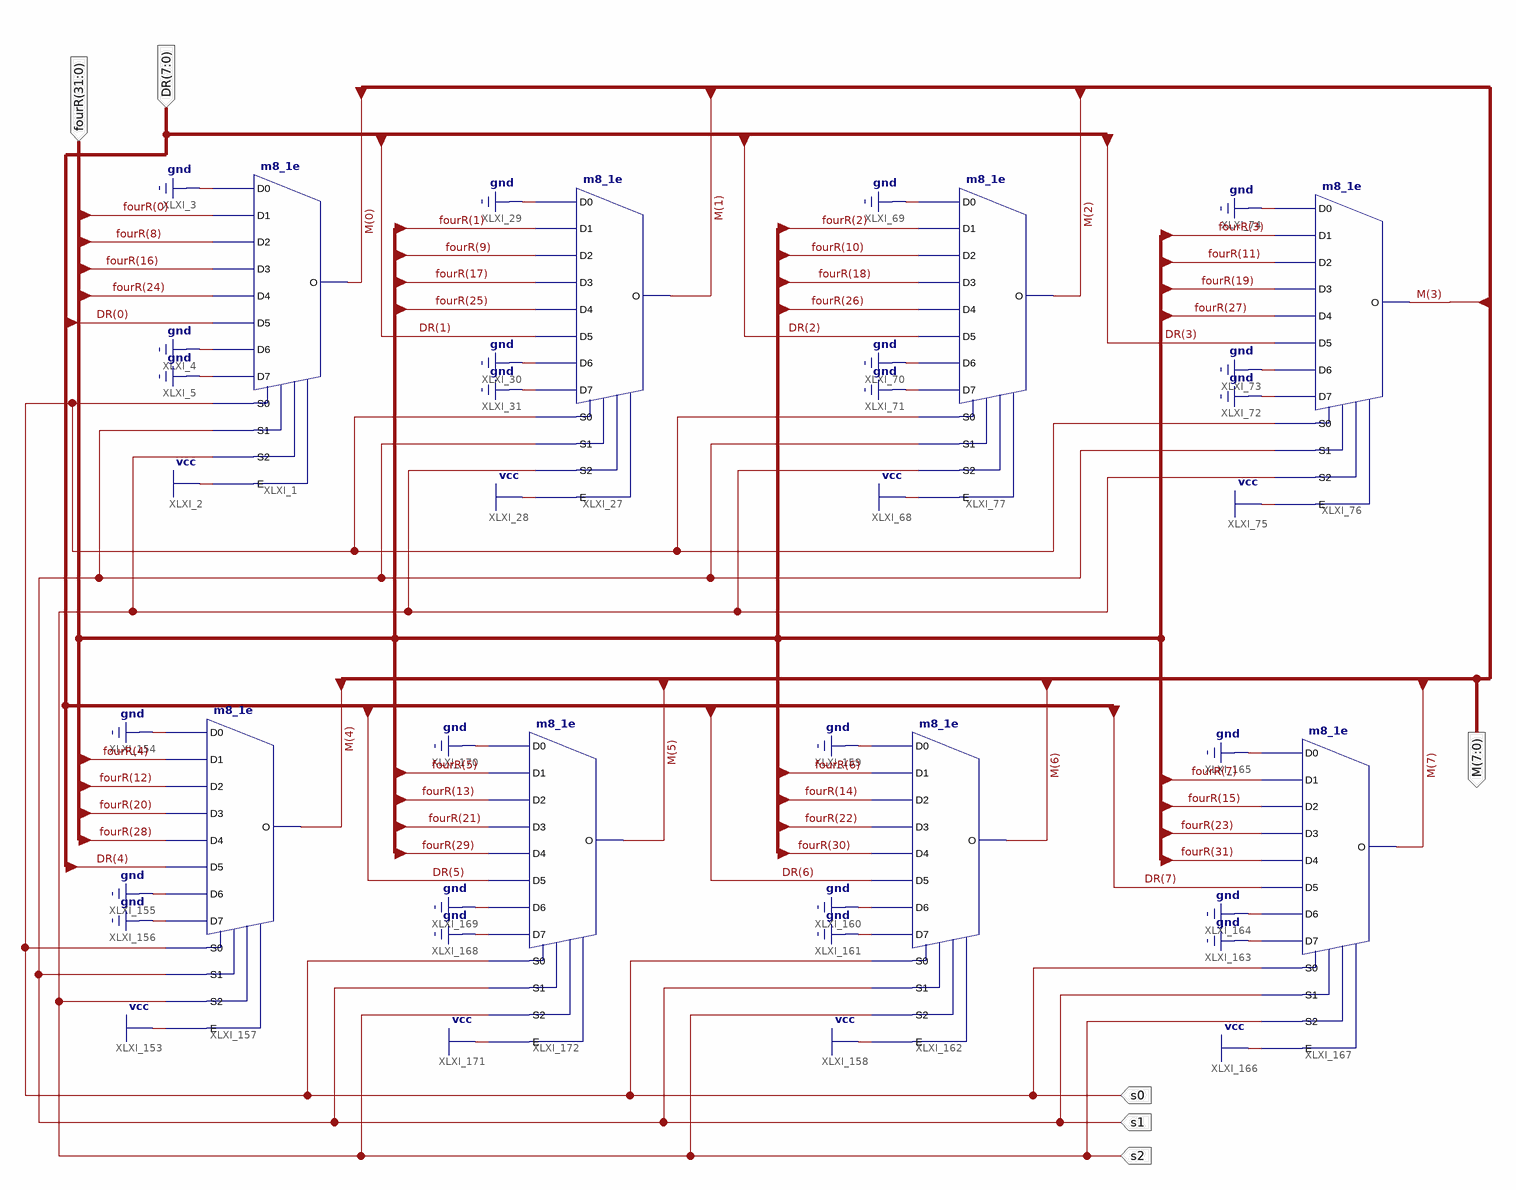
[diagram p0: schematic sheet 1]
// Xilinx ISE schematic muxB.sch (spartan3e) as structural Verilog: 8 symbols, 6 ports
module muxB (
  input  s0,
  input  s1,
  input  s2,
  input  [31:0] fourR,
  input  [7:0] DR,
  output [7:0] M
);

  m8_1e XLXI_1 (
    .D0(1'b0), .D1(fourR[0]), .D2(fourR[8]), .D3(fourR[16]), .D4(fourR[24]), .D5(DR[0]), .D6(1'b0),
    .D7(1'b0), .E(1'b1), .S0(s0), .S1(s1), .S2(s2), .O(M[0]));
  m8_1e XLXI_77 (
    .D0(1'b0), .D1(fourR[2]), .D2(fourR[10]), .D3(fourR[18]), .D4(fourR[26]), .D5(DR[2]), .D6(1'b0),
    .D7(1'b0), .E(1'b1), .S0(s0), .S1(s1), .S2(s2), .O(M[2]));
  m8_1e XLXI_27 (
    .D0(1'b0), .D1(fourR[1]), .D2(fourR[9]), .D3(fourR[17]), .D4(fourR[25]), .D5(DR[1]), .D6(1'b0),
    .D7(1'b0), .E(1'b1), .S0(s0), .S1(s1), .S2(s2), .O(M[1]));
  m8_1e XLXI_157 (
    .D0(1'b0), .D1(fourR[4]), .D2(fourR[12]), .D3(fourR[20]), .D4(fourR[28]), .D5(DR[4]), .D6(1'b0),
    .D7(1'b0), .E(1'b1), .S0(s0), .S1(s1), .S2(s2), .O(M[4]));
  m8_1e XLXI_162 (
    .D0(1'b0), .D1(fourR[6]), .D2(fourR[14]), .D3(fourR[22]), .D4(fourR[30]), .D5(DR[6]), .D6(1'b0),
    .D7(1'b0), .E(1'b1), .S0(s0), .S1(s1), .S2(s2), .O(M[6]));
  m8_1e XLXI_167 (
    .D0(1'b0), .D1(fourR[7]), .D2(fourR[15]), .D3(fourR[23]), .D4(fourR[31]), .D5(DR[7]), .D6(1'b0),
    .D7(1'b0), .E(1'b1), .S0(s0), .S1(s1), .S2(s2), .O(M[7]));
  m8_1e XLXI_172 (
    .D0(1'b0), .D1(fourR[5]), .D2(fourR[13]), .D3(fourR[21]), .D4(fourR[29]), .D5(DR[5]), .D6(1'b0),
    .D7(1'b0), .E(1'b1), .S0(s0), .S1(s1), .S2(s2), .O(M[5]));
  m8_1e XLXI_76 (
    .D0(1'b0), .D1(fourR[3]), .D2(fourR[11]), .D3(fourR[19]), .D4(fourR[27]), .D5(DR[3]), .D6(1'b0),
    .D7(1'b0), .E(1'b1), .S0(s0), .S1(s1), .S2(s2), .O(M[3]));
endmodule
